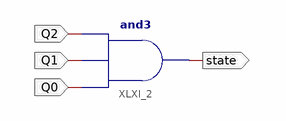
[diagram p0: schematic sheet 1]
// Xilinx ISE schematic StateOK.sch (spartan3e) as structural Verilog: 1 symbols, 4 ports
module StateOK (
  input  Q0,
  input  Q1,
  input  Q2,
  output state
);

  and XLXI_2 (state, Q0, Q1, Q2);
endmodule
